# Altium project power_12v_5V_3V3.PrjPcb
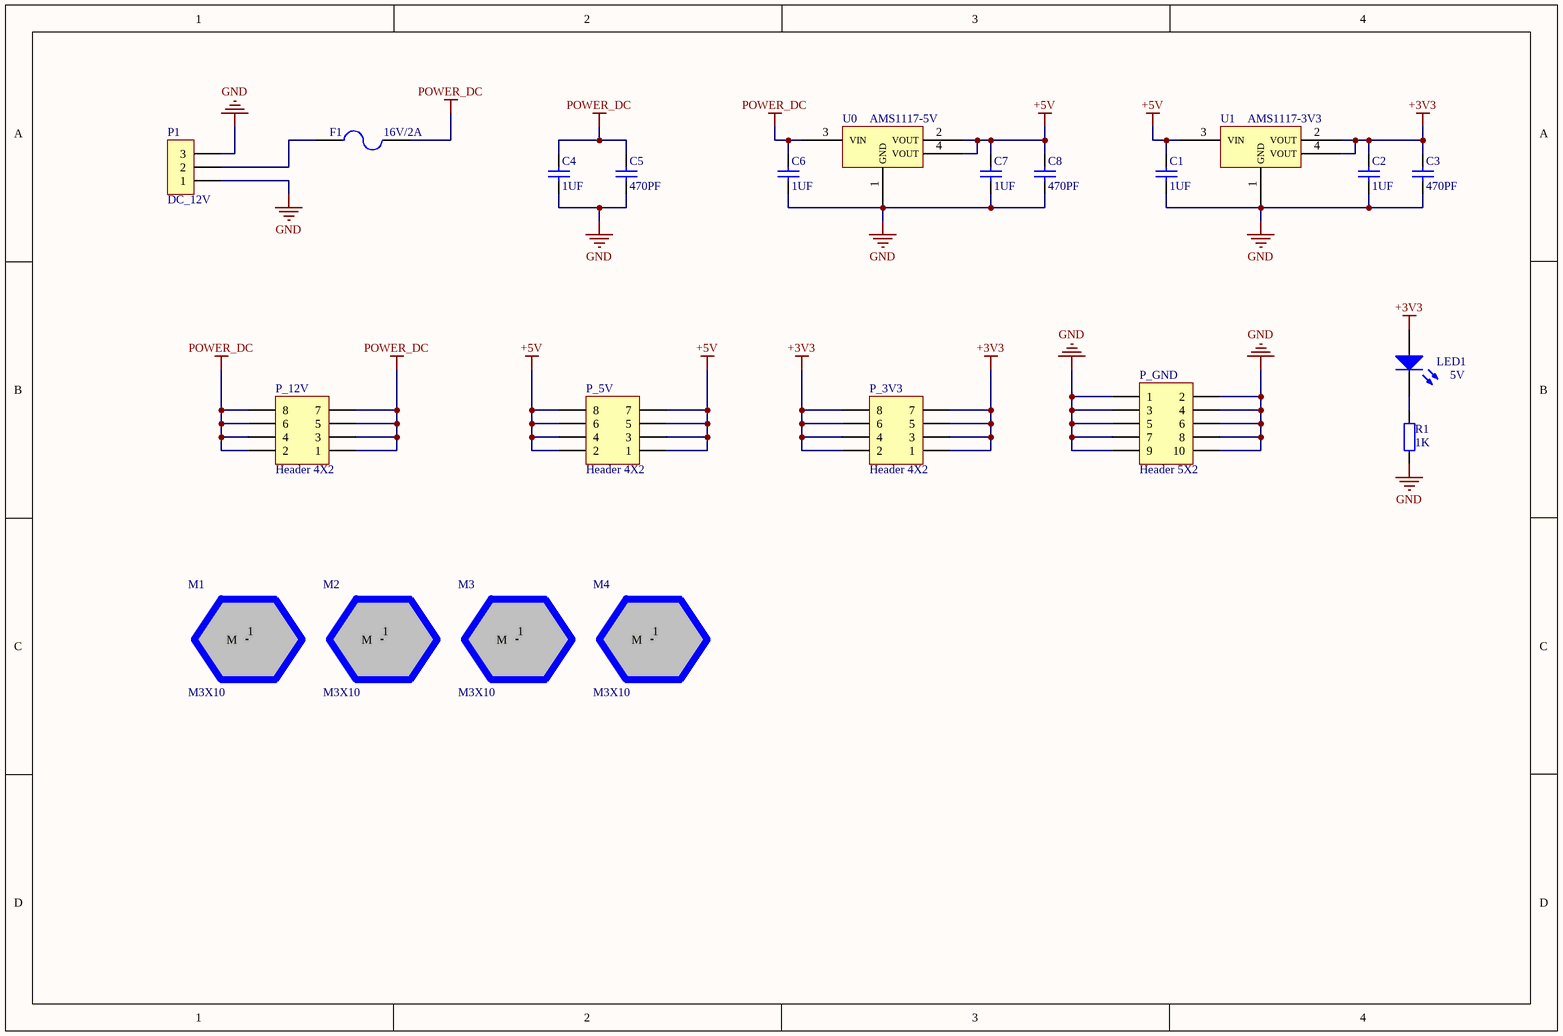
[diagram p0: power_12V_5V_3V3_V10.SchDoc]
1 sheet, 22 parts. Net scope: global (net labels, ports and power ports of the same name join across sheets).
Board file: power_12V_5V_3V3_V10.PcbDoc

## Sheet power_12V_5V_3V3_V10.SchDoc
size A4

### Parts
C1  Cap  [C 0603_M]  (value not drawn)
C2  Cap  [C 0603_M]  (value not drawn)
C3  Cap  [C 0603_M]  (value not drawn)
C4  Cap  [C 0603_M]  (value not drawn)
C5  Cap  [C 0603_M]  (value not drawn)
C6  Cap  [C 0603_M]  (value not drawn)
C7  Cap  [C 0603_M]  (value not drawn)
C8  Cap  [C 0603_M]  (value not drawn)
F1  Fuse 2  [FU 1812]  (value not drawn)
LED1  5V  [LED 0603Y]
M1  M3X10  [M3X10_L]
M2  M3X10  [M3X10_L]
M3  M3X10  [M3X10_L]
M4  M3X10  [M3X10_L]
P1  DC_12V  [DC-5MM]
P_3V3  Header 4X2  [HDR2.54-LI-2x4P]
P_5V  Header 4X2  [HDR2.54-LI-2x4P]
P_12V  Header 4X2  [HDR2.54-LI-2x4P]
P_GND  Header 5X2  [HDR2.54-LI-2x5P]
R1  1K  [R 0603-HP_M]
U0  AMS1117-5V  [SOT223_M]
U1  AMS1117-3V3  [SOT223_M]

### Nets
+3V3: C2.2 C3.2 LED1.1(A) P_3V3.1 P_3V3.2 P_3V3.3 P_3V3.4 P_3V3.5 P_3V3.6 P_3V3.7 P_3V3.8 U1.2(VOUT) U1.4(VOUT)
+5V: C1.2 C7.2 C8.2 P_5V.1 P_5V.2 P_5V.3 P_5V.4 P_5V.5 P_5V.6 P_5V.7 P_5V.8 U0.2(VOUT) U0.4(VOUT) U1.3(VIN)
GND: C1.1 C2.1 C3.1 C4.1 C5.1 C6.1 C7.1 C8.1 P1.1 P1.3 P_GND.1 P_GND.2 P_GND.3 P_GND.4 P_GND.5 P_GND.6 P_GND.7 P_GND.8 P_GND.9 P_GND.10 R1.1 U0.1(GND) U1.1(GND)
POWER_DC: C4.2 C5.2 C6.2 F1.2 P_12V.1 P_12V.2 P_12V.3 P_12V.4 P_12V.5 P_12V.6 P_12V.7 P_12V.8 U0.3(VIN)
NetF1_1: F1.1 P1.2
NetLED1_2: LED1.2(K) R1.2

Not connected (* = marked no-connect by the designer): M1 1(M); M2 1(M); M3 1(M); M4 1(M)

### Notes on the sheet
- (in symbol Cap) 470PF; 1UF
- (in symbol Fuse 2) 16V/2A

### Library data of the parts
C1-C8 = Cap: Capacitor; Published: 8-Jun-2000; LatestRevisionDate: 17-Jul-2002; LatestRevisionNote: Re-released for DXP Platform.; PackageReference: RAD-0.3; Publisher: Altium Limited
F1 = Fuse 2: Fuse; Published: 8-Jun-2000; LatestRevisionDate: 17-Jul-2002; LatestRevisionNote: Re-released for DXP Platform.; PackageReference: PIN-W2/E2.8; Publisher: Altium Limited; PackageDescription: Thru-Hole; 2 Leads
LED1 = LED2: Typical RED, GREEN, YELLOW, AMBER GaAs LED; Published: 8-Jun-2000; LatestRevisionDate: 17-Jul-2002; LatestRevisionNote: Re-released for DXP Platform.; PackageDocument: Feb-2002; PackageReference: 3.2X1.6X1.1; Publisher: Altium Limited
P1 = PIN3
P_3V3 P_5V P_12V = Header 4X2: Header, 4-Pin, Dual row; LatestRevisionDate: 17-Jul-2002; LatestRevisionNote: Re-released for DXP Platform.; Publisher: Altium Limited
P_GND = Header 5X2: Header, 5-Pin, Dual row; LatestRevisionDate: 17-Jul-2002; LatestRevisionNote: Re-released for DXP Platform.; Publisher: Altium Limited
R1 = Res2: Resistor; Published: 8-Jun-2000; LatestRevisionDate: 17-Jul-2002; LatestRevisionNote: Re-released for DXP Platform.; PackageReference: AXIAL-0.4; Publisher: Altium Limited
U0 U1 = ASM1117-3V3